# EAGLE schematic 2wire-1602-v0 (EAGLE 5.07)
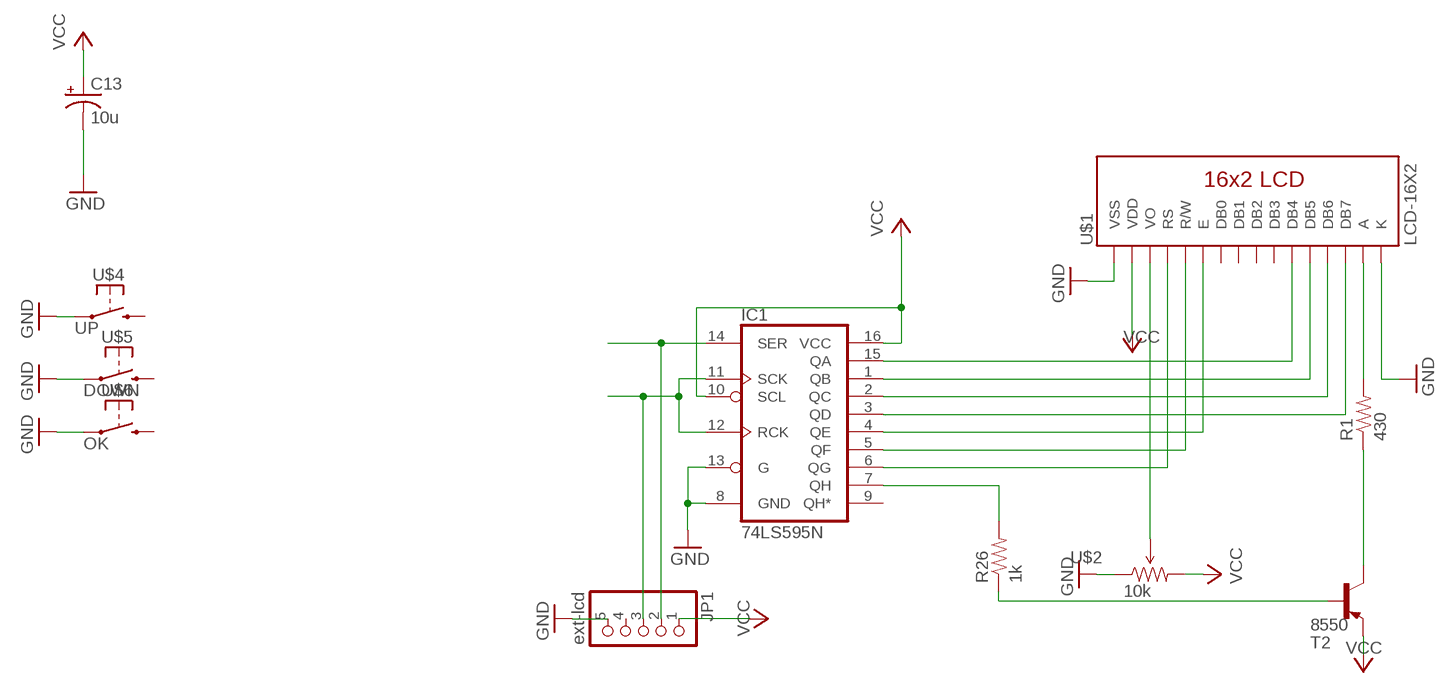
[diagram p0: schematic, sheet 1]

## Parts
C13  10u  CAP_POLPTH1  [CPOL-RADIAL-100UF-25V]
IC1  74LS595N  [DIL16]
JP1  ext-lcd  PINHD-1X5/90  [1X05/90]
R1  430  RESISTOR1/4W  [AXIAL-0.3]
R26  1k  RESISTOR0805  [0805]
T2  8550  -PNP-TO92-EBC  [TO92-EBC]
U$1  LCD-16X2  [LCD-16X2]
U$2  10k  TRIMPOTPTH  [TRIM_POT_PTH]
U$4  UP  TACT_SWITCH-2-PTH  [ALPS-SKHV]
U$5  DOWN  TACT_SWITCH-2-PTH  [ALPS-SKHV]
U$6  OK  TACT_SWITCH-2-PTH  [ALPS-SKHV]

## Nets
GND: C13.2(-) IC1.8(GND) IC1.13(G) JP1.5 U$1.1(VSS) U$1.16(K) U$2.1(CCW) U$4.2 U$5.2 U$6.2
N$1: IC1.15(QA) U$1.11(DB4)
N$2: IC1.1(QB) U$1.12(DB5)
N$3: IC1.2(QC) U$1.13(DB6)
N$4: IC1.3(QD) U$1.14(DB7)
N$5: IC1.4(QE) U$1.6(E)
N$6: IC1.5(QF) U$1.5(R/W)
N$7: IC1.6(QG) U$1.4(RS)
N$8: IC1.7(QH) R26.2
N$10: IC1.14(SER) JP1.2
N$12: IC1.11(SCK) IC1.12(RCK) JP1.3
N$15: U$1.3(VO) U$2.2(WIPER)
N$16: R1.P$2 U$1.15(A)
N$19: R1.P$1 T2.C
N$55: R26.1 T2.B
VCC: C13.1(+) IC1.10(SCL) IC1.16(VCC) JP1.1 T2.E U$1.2(VDD) U$2.3(CW)
Unconnected: IC1.9(QH*) JP1.4 U$1.7(DB0) U$1.8(DB1) U$1.9(DB2) U$1.10(DB3) U$4.3 U$5.3 U$6.3

## Library data of the parts
C13 = SparkFun:CAP_POL: Capacitor Polarized These are standard SMD and PTH capacitors. Normally 10uF, 47uF, and 100uF in electrolytic and tantalum varieties. Always verify the external diameter of the through hole cap, it varies with capacity, voltage, and manufacturer. The EIA devices should be standard.
IC1 = SparkFun:74*595: 8-bit SHIFT REGISTER, output latch
JP1 = pinhead:PINHD-1X5: PIN HEADER
R1 R26 = digital-toy:RESISTOR: Resistor Basic schematic elements and footprints for 0603, 1206, and PTH 1/10th watt (small) resistors. digital-toy copy vertical mount of axial-0.3 from rcl.lbr : the 0207/xx
T2 = digital-toy:*-PNP-: PNP Transistror
U$1 = digital-toy:LCD-16X2
U$2 = SparkFun:TRIMPOT
U$4-U$6 = digital-toy:TACT_SWITCH-2